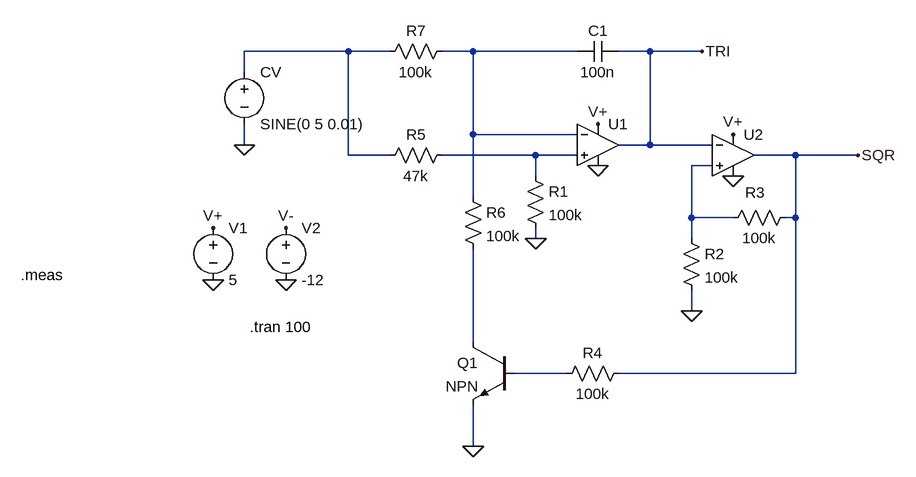
[diagram p0: schematic skull_lfo.asc]
skull_lfo.asc, the LTspice schematic file:
Version 4
SHEET 1 880 680
WIRE -192 16 -352 16
WIRE -128 16 -192 16
WIRE 0 16 -48 16
WIRE 160 16 0 16
WIRE 272 16 224 16
WIRE 352 16 272 16
WIRE -352 48 -352 16
WIRE 0 144 0 16
WIRE 160 144 0 144
WIRE -352 160 -352 128
WIRE 272 160 272 16
WIRE 272 160 224 160
WIRE 368 160 272 160
WIRE -192 176 -192 16
WIRE -128 176 -192 176
WIRE 96 176 -48 176
WIRE 160 176 96 176
WIRE 496 176 432 176
WIRE 592 176 496 176
WIRE 368 192 336 192
WIRE 96 208 96 176
WIRE 0 240 0 144
WIRE 336 272 336 192
WIRE 400 272 336 272
WIRE 496 272 496 176
WIRE 496 272 480 272
WIRE 96 304 96 288
WIRE 336 304 336 272
WIRE 336 416 336 384
WIRE 0 464 0 320
WIRE 144 512 64 512
WIRE 496 512 496 272
WIRE 496 512 224 512
WIRE 0 624 0 560
FLAG -400 288 V+
FLAG -288 288 V-
FLAG -400 368 0
FLAG -288 368 0
FLAG 192 128 V+
FLAG 400 144 V+
FLAG 336 416 0
FLAG 0 624 0
FLAG 96 304 0
FLAG 352 16 TRI
FLAG 592 176 SQR
FLAG -352 160 0
FLAG 400 208 0
FLAG 192 192 0
SYMBOL OpAmps\\UniversalOpamp2 192 160 R0
SYMATTR InstName U1
SYMBOL OpAmps\\UniversalOpamp2 400 176 R0
SYMATTR InstName U2
SYMBOL voltage -400 272 R0
WINDOW 123 0 0 Left 0
WINDOW 39 0 0 Left 0
SYMATTR InstName V1
SYMATTR Value 5
SYMBOL voltage -288 272 R0
WINDOW 123 0 0 Left 0
WINDOW 39 0 0 Left 0
SYMATTR InstName V2
SYMATTR Value -12
SYMBOL res 80 192 R0
SYMATTR InstName R1
SYMATTR Value 100k
SYMBOL res 320 288 R0
SYMATTR InstName R2
SYMATTR Value 100k
SYMBOL res 496 256 R90
WINDOW 0 -7 62 VBottom 2
WINDOW 3 32 56 VTop 2
SYMATTR InstName R3
SYMATTR Value 100k
SYMBOL npn 64 464 M0
SYMATTR InstName Q1
SYMBOL res 240 496 R90
WINDOW 0 0 56 VBottom 2
WINDOW 3 32 56 VTop 2
SYMATTR InstName R4
SYMATTR Value 100k
SYMBOL res -32 160 R90
WINDOW 0 0 56 VBottom 2
WINDOW 3 32 56 VTop 2
SYMATTR InstName R5
SYMATTR Value 47k
SYMBOL res -16 224 R0
SYMATTR InstName R6
SYMATTR Value 100k
SYMBOL cap 224 0 R90
WINDOW 0 0 32 VBottom 2
WINDOW 3 32 32 VTop 2
SYMATTR InstName C1
SYMATTR Value 100n
SYMBOL res -32 0 R90
WINDOW 0 0 56 VBottom 2
WINDOW 3 32 56 VTop 2
SYMATTR InstName R7
SYMATTR Value 100k
SYMBOL voltage -352 32 R0
WINDOW 123 0 0 Left 0
WINDOW 39 0 0 Left 0
SYMATTR InstName CV
SYMATTR Value SINE(0 5 0.01)
TEXT -344 440 Left 2 !.tran 100
TEXT -696 360 Left 2 !.meas

The netlist it stands for:
* skull_lfo.asc
XU1 N003 N002 V+ 0 TRI level.2 Avol=1Meg GBW=10Meg Slew=10Meg ilimit=25m rail=0 Vos=0 phimargin=45 en=0 enk=0 in=0 ink=0 Rin=500Meg  ; pins IN+ IN- V+ V- OUT
XU2 N004 TRI V+ 0 SQR level.2 Avol=1Meg GBW=10Meg Slew=10Meg ilimit=25m rail=0 Vos=0 phimargin=45 en=0 enk=0 in=0 ink=0 Rin=500Meg  ; pins IN+ IN- V+ V- OUT
V1 V+ 0 5
V2 V- 0 -12
R1 N003 0 100k
R2 N004 0 100k
R3 SQR N004 100k
Q1 N005 N006 0 0 NPN
R4 SQR N006 100k
R5 N003 N001 47k
R6 N002 N005 100k
C1 TRI N002 100n
R7 N002 N001 100k
V§CV N001 0 SINE(0 5 0.01)
.model NPN NPN
.model PNP PNP
.lib standard.bjt
.tran 100
.meas
.lib UniversalOpamps2.sub
.backanno
.end